# Altium schematic sheet controlo_rev3.SchDoc
size A3
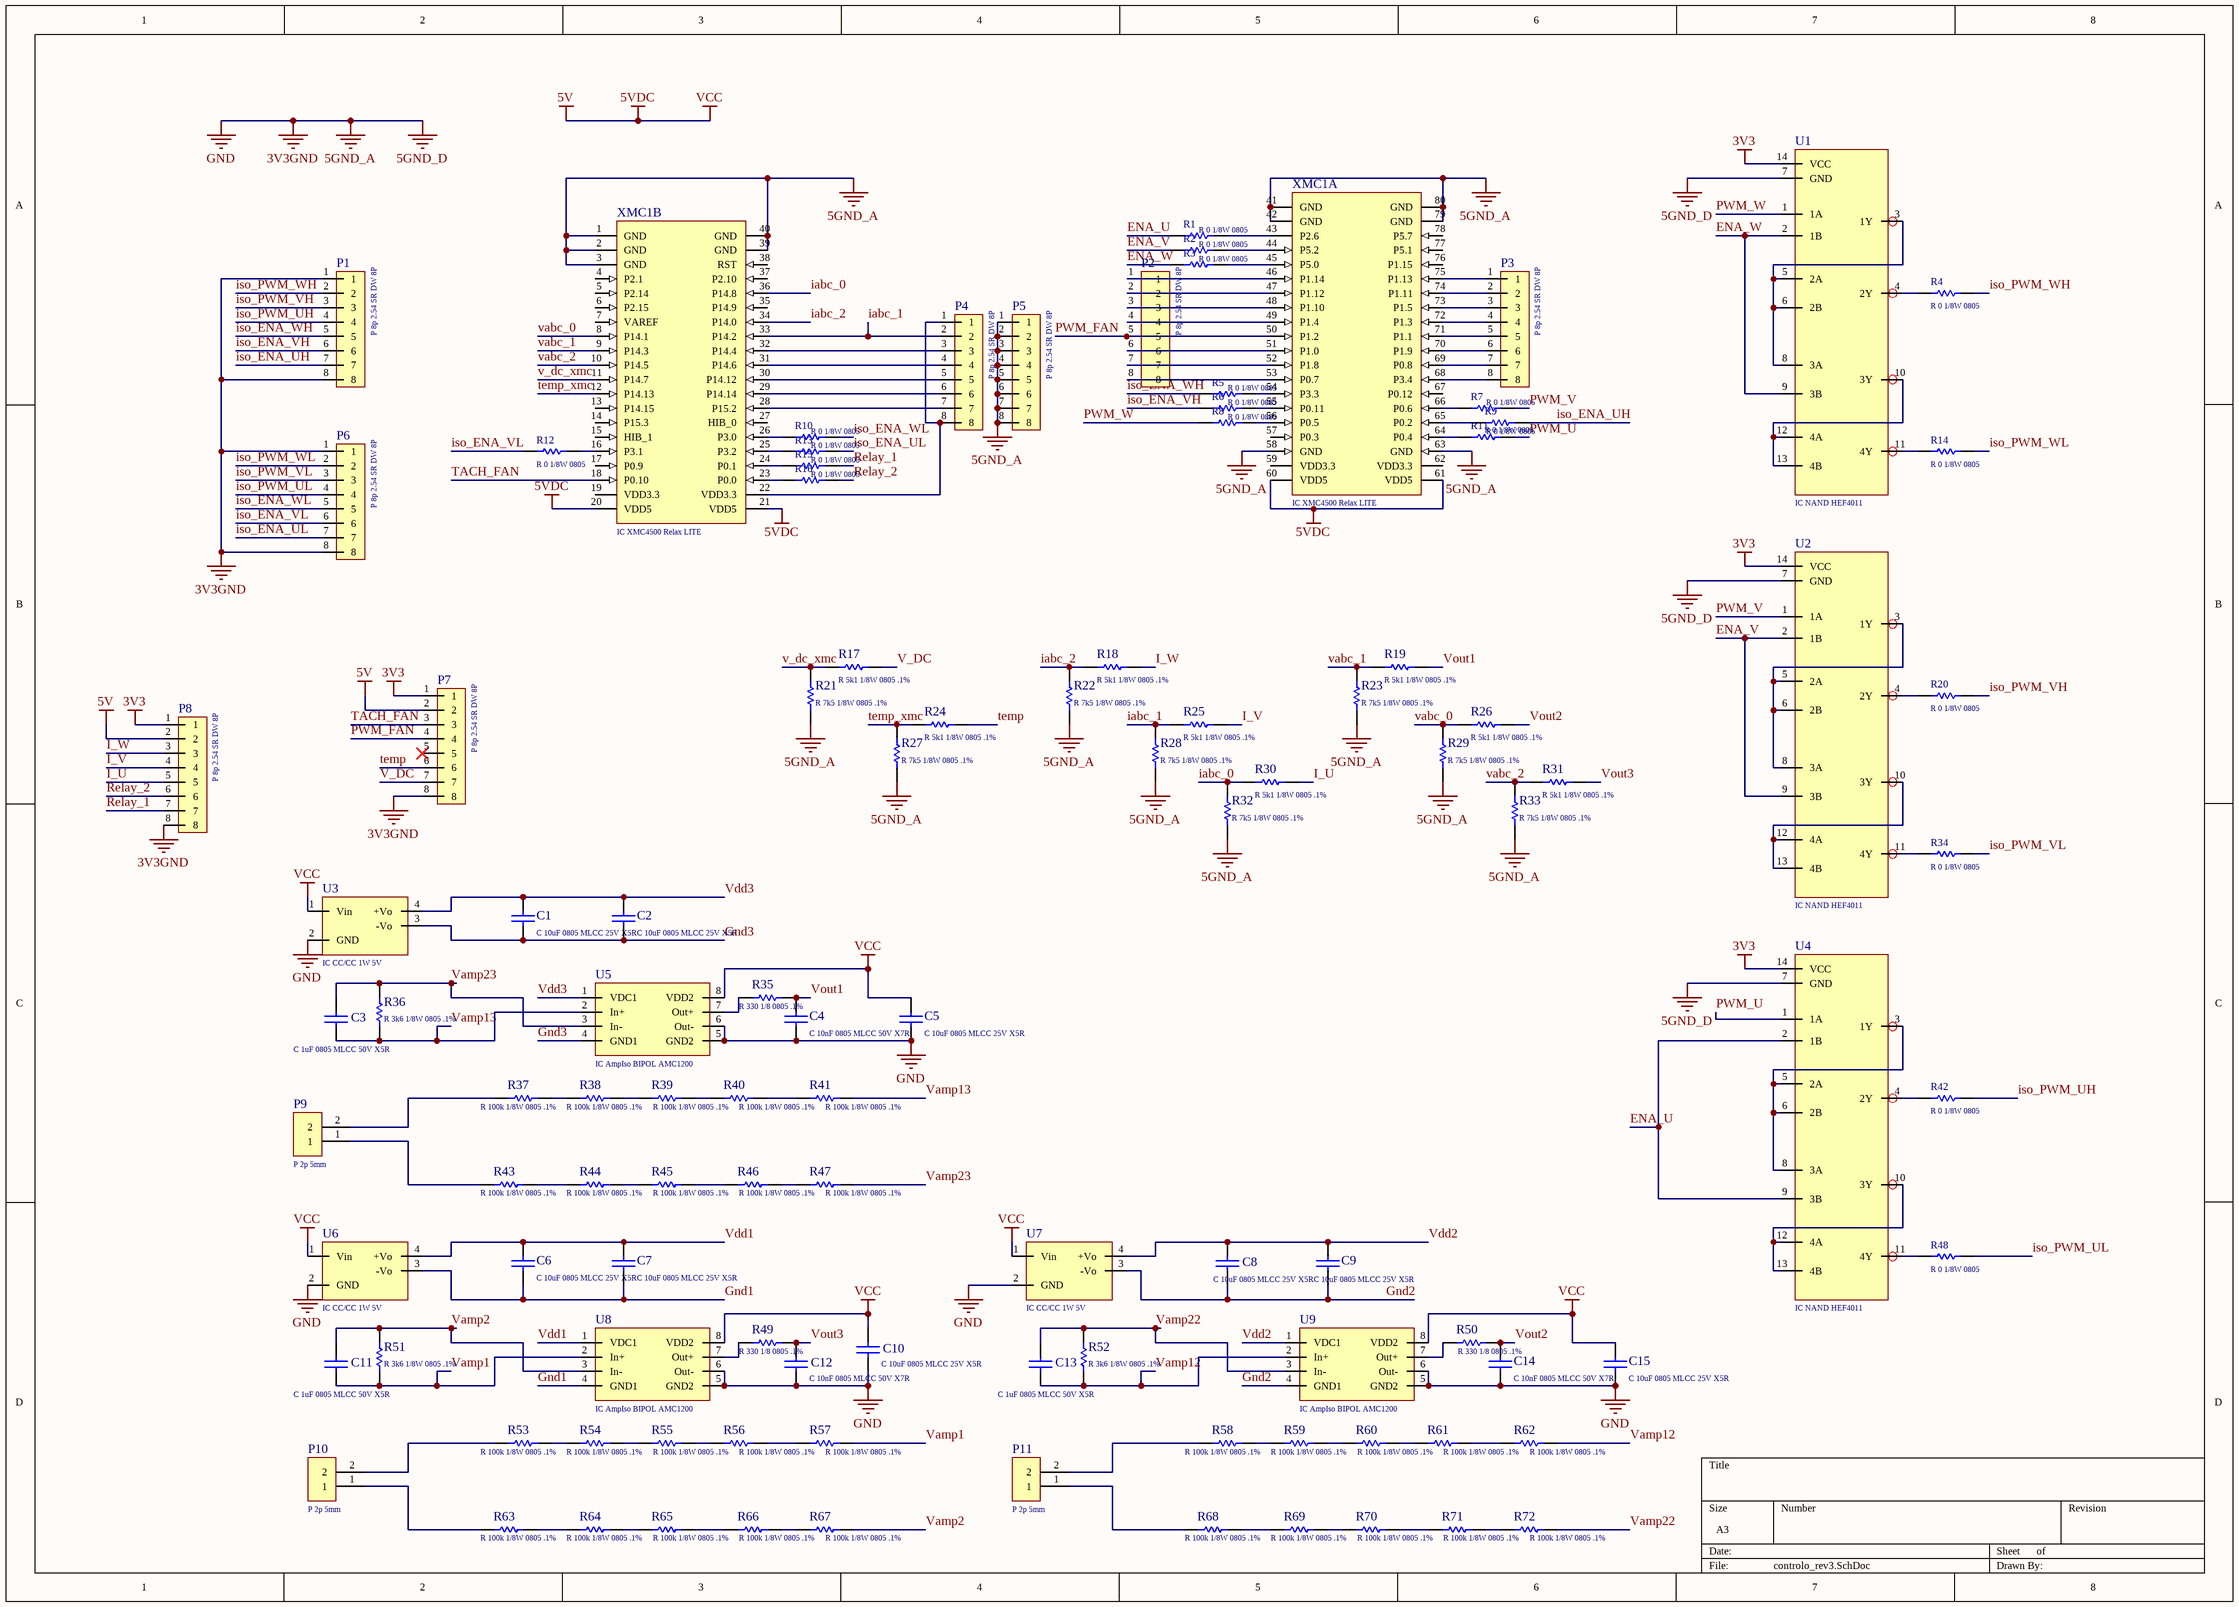
[diagram p0: controlo_rev3.SchDoc]

## Parts
C1  C 10uF 0805 MLCC 25V X5R  [CAPC_0805]
C2  C 10uF 0805 MLCC 25V X5R  [CAPC_0805]
C3  C 1uF 0805 MLCC 50V X5R  [CAPC_0805]
C4  C 10nF 0805 MLCC 50V X7R  [CAPC_0805]
C5  C 10uF 0805 MLCC 25V X5R  [CAPC_0805]
C6  C 10uF 0805 MLCC 25V X5R  [CAPC_0805]
C7  C 10uF 0805 MLCC 25V X5R  [CAPC_0805]
C8  C 10uF 0805 MLCC 25V X5R  [CAPC_0805]
C9  C 10uF 0805 MLCC 25V X5R  [CAPC_0805]
C10  C 10uF 0805 MLCC 25V X5R  [CAPC_0805]
C11  C 1uF 0805 MLCC 50V X5R  [CAPC_0805]
C12  C 10nF 0805 MLCC 50V X7R  [CAPC_0805]
C13  C 1uF 0805 MLCC 50V X5R  [CAPC_0805]
C14  C 10nF 0805 MLCC 50V X7R  [CAPC_0805]
C15  C 10uF 0805 MLCC 25V X5R  [CAPC_0805]
P1  P 8p 2.54 SR DW 8P  [Header 8x1 8.5mm]
P2  P 8p 2.54 SR DW 8P  [Header 8x1 8.5mm]
P3  P 8p 2.54 SR DW 8P  [Header 8x1 8.5mm]
P4  P 8p 2.54 SR DW 8P  [Header 8x1 8.5mm]
P5  P 8p 2.54 SR DW 8P  [Header 8x1 8.5mm]
P6  P 8p 2.54 SR DW 8P  [Header 8x1 8.5mm]
P7  P 8p 2.54 SR DW 8P  [Header 8x1 8.5mm]
P8  P 8p 2.54 SR DW 8P  [Header 8x1 8.5mm]
P9  P 2p 5mm  [connector1x2_parafuso]
P10  P 2p 5mm  [connector1x2_parafuso]
P11  P 2p 5mm  [connector1x2_parafuso]
R1  R 0 1/8W 0805  [RESC_0805]
R2  R 0 1/8W 0805  [RESC_0805]
R3  R 0 1/8W 0805  [RESC_0805]
R4  R 0 1/8W 0805  [RESC_0805]
R5  R 0 1/8W 0805  [RESC_0805]
R6  R 0 1/8W 0805  [RESC_0805]
R7  R 0 1/8W 0805  [RESC_0805]
R8  R 0 1/8W 0805  [RESC_0805]
R9  R 0 1/8W 0805  [RESC_0805]
R10  R 0 1/8W 0805  [RESC_0805]
R11  R 0 1/8W 0805  [RESC_0805]
R12  R 0 1/8W 0805  [RESC_0805]
R13  R 0 1/8W 0805  [RESC_0805]
R14  R 0 1/8W 0805  [RESC_0805]
R15  R 0 1/8W 0805  [RESC_0805]
R16  R 0 1/8W 0805  [RESC_0805]
R17  R 5k1 1/8W 0805 .1%  [RESC_0805]
R18  R 5k1 1/8W 0805 .1%  [RESC_0805]
R19  R 5k1 1/8W 0805 .1%  [RESC_0805]
R20  R 0 1/8W 0805  [RESC_0805]
R21  R 7k5 1/8W 0805 .1%  [RESC_0805]
R22  R 7k5 1/8W 0805 .1%  [RESC_0805]
R23  R 7k5 1/8W 0805 .1%  [RESC_0805]
R24  R 5k1 1/8W 0805 .1%  [RESC_0805]
R25  R 5k1 1/8W 0805 .1%  [RESC_0805]
R26  R 5k1 1/8W 0805 .1%  [RESC_0805]
R27  R 7k5 1/8W 0805 .1%  [RESC_0805]
R28  R 7k5 1/8W 0805 .1%  [RESC_0805]
R29  R 7k5 1/8W 0805 .1%  [RESC_0805]
R30  R 5k1 1/8W 0805 .1%  [RESC_0805]
R31  R 5k1 1/8W 0805 .1%  [RESC_0805]
R32  R 7k5 1/8W 0805 .1%  [RESC_0805]
R33  R 7k5 1/8W 0805 .1%  [RESC_0805]
R34  R 0 1/8W 0805  [RESC_0805]
R35  R 330 1/8 0805 .1%  [RESC_0805]
R36  R 3k6 1/8W 0805 .1%  [RESC_0805]
R37  R 100k 1/8W 0805 .1%  [RESC_0805]
R38  R 100k 1/8W 0805 .1%  [RESC_0805]
R39  R 100k 1/8W 0805 .1%  [RESC_0805]
R40  R 100k 1/8W 0805 .1%  [RESC_0805]
R41  R 100k 1/8W 0805 .1%  [RESC_0805]
R42  R 0 1/8W 0805  [RESC_0805]
R43  R 100k 1/8W 0805 .1%  [RESC_0805]
R44  R 100k 1/8W 0805 .1%  [RESC_0805]
R45  R 100k 1/8W 0805 .1%  [RESC_0805]
R46  R 100k 1/8W 0805 .1%  [RESC_0805]
R47  R 100k 1/8W 0805 .1%  [RESC_0805]
R48  R 0 1/8W 0805  [RESC_0805]
R49  R 330 1/8 0805 .1%  [RESC_0805]
R50  R 330 1/8 0805 .1%  [RESC_0805]
R51  R 3k6 1/8W 0805 .1%  [RESC_0805]
R52  R 3k6 1/8W 0805 .1%  [RESC_0805]
R53  R 100k 1/8W 0805 .1%  [RESC_0805]
R54  R 100k 1/8W 0805 .1%  [RESC_0805]
R55  R 100k 1/8W 0805 .1%  [RESC_0805]
R56  R 100k 1/8W 0805 .1%  [RESC_0805]
R57  R 100k 1/8W 0805 .1%  [RESC_0805]
R58  R 100k 1/8W 0805 .1%  [RESC_0805]
R59  R 100k 1/8W 0805 .1%  [RESC_0805]
R60  R 100k 1/8W 0805 .1%  [RESC_0805]
R61  R 100k 1/8W 0805 .1%  [RESC_0805]
R62  R 100k 1/8W 0805 .1%  [RESC_0805]
R63  R 100k 1/8W 0805 .1%  [RESC_0805]
R64  R 100k 1/8W 0805 .1%  [RESC_0805]
R65  R 100k 1/8W 0805 .1%  [RESC_0805]
R66  R 100k 1/8W 0805 .1%  [RESC_0805]
R67  R 100k 1/8W 0805 .1%  [RESC_0805]
R68  R 100k 1/8W 0805 .1%  [RESC_0805]
R69  R 100k 1/8W 0805 .1%  [RESC_0805]
R70  R 100k 1/8W 0805 .1%  [RESC_0805]
R71  R 100k 1/8W 0805 .1%  [RESC_0805]
R72  R 100k 1/8W 0805 .1%  [RESC_0805]
U1  IC NAND HEF4011  [SOIC-14N]
U2  IC NAND HEF4011  [SOIC-14N]
U3  IC CC/CC 1W 5V  [DC/DC_ISO]
U4  IC NAND HEF4011  [SOIC-14N]
U5  IC AmpIso BIPOL AMC1200  [SOIC8]
U6  IC CC/CC 1W 5V  [DC/DC_ISO]
U7  IC CC/CC 1W 5V  [DC/DC_ISO]
U8  IC AmpIso BIPOL AMC1200  [SOIC8]
U9  IC AmpIso BIPOL AMC1200  [SOIC8]
XMC1  IC XMC4500 Relax LITE  [XMC4500]  (parts A,B of 2)

## Nets
3V3: P7.1 P8.1 U1.14(VCC) U2.14(VCC) U4.14(VCC)
3V3GND: C4.1 C5.1 C10.1 C12.1 C14.1 C15.1 P1.1 P1.8 P5.1 P5.2 P5.3 P5.4 P5.5 P5.6 P5.7 P5.8 P6.1 P6.8 P7.8 P8.8 R21.1 R22.1 R23.1 R27.1 R28.1 R29.1 R32.1 R33.1 U1.7(GND) U2.7(GND) U3.2(GND) U4.7(GND) U5.5(GND2) U5.6(Out-) U6.2(GND) U7.2(GND) U8.5(GND2) U8.6(Out-) U9.5(GND2) U9.6(Out-) XMC1.1(GND) XMC1.2(GND) XMC1.3(GND) XMC1.39(GND) XMC1.40(GND) XMC1.41(GND) XMC1.42(GND) XMC1.58(GND) XMC1.63(GND) XMC1.79(GND) XMC1.80(GND)  [also labelled 5GND_A, 5GND_D, GND]
5V: C5.2 C10.2 C15.2 P7.2 P8.2 U3.1(Vin) U5.8(VDD2) U6.1(Vin) U7.1(Vin) U8.8(VDD2) U9.8(VDD2) XMC1.20(VDD5) XMC1.21(VDD5) XMC1.60(VDD5) XMC1.61(VDD5)  [also labelled 5VDC, VCC]
ENA_U: R1.1 U4.2(1B) U4.9(3B)
ENA_V: R2.1 U2.2(1B) U2.9(3B)
ENA_W: R3.1 U1.2(1B) U1.9(3B)
Gnd1: C6.1 C7.1 U6.3(-Vo) U8.4(GND1)
Gnd2: C8.1 C9.1 U7.3(-Vo) U9.4(GND1)
Gnd3: C1.1 C2.1 U3.3(-Vo) U5.4(GND1)
I_U: P8.5 R30.2
I_V: P8.4 R25.2
I_W: P8.3 R18.2
iabc_0: R30.1 R32.2 XMC1.36(P14.8)
iabc_1: P4.2 R25.1 R28.2 XMC1.33(P14.2)
iabc_2: R18.1 R22.2 XMC1.34(P14.0)
iso_ENA_UH: P1.7 R9.1
iso_ENA_UL: P6.7 R13.2
iso_ENA_VH: P1.6 R6.1
iso_ENA_VL: P6.6 R12.1
iso_ENA_WH: P1.5 R5.1
iso_ENA_WL: P6.5 R10.2
iso_PWM_UH: P1.4 R42.2
iso_PWM_UL: P6.4 R48.2
iso_PWM_VH: P1.3 R20.2
iso_PWM_VL: P6.3 R34.2
iso_PWM_WH: P1.2 R4.2
iso_PWM_WL: P6.2 R14.2
PWM_FAN: P2.5 P7.4 XMC1.50(P1.2)
PWM_U: R11.2 U4.1(1A)
PWM_V: R7.2 U2.1(1A)
PWM_W: R8.1 U1.1(1A)
Relay_1: P8.7 R15.2
Relay_2: P8.6 R16.2
TACH_FAN: P7.3 XMC1.18(P0.10)
temp: P7.6 R24.2
temp_xmc: R24.1 R27.2 XMC1.12(P14.13)
V_DC: P7.7 R17.2
v_dc_xmc: R17.1 R21.2 XMC1.11(P14.7)
vabc_0: R26.1 R29.2 XMC1.8(P14.1)
vabc_1: R19.1 R23.2 XMC1.9(P14.3)
vabc_2: R31.1 R33.2 XMC1.10(P14.5)
Vamp1: C11.1 R51.1 R57.2 U8.2(In+)
Vamp2: C11.2 R51.2 R67.2 U8.3(In-)
Vamp12: C13.1 R52.1 R62.2 U9.2(In+)
Vamp13: C3.1 R36.1 R41.2 U5.2(In+)
Vamp22: C13.2 R52.2 R72.2 U9.3(In-)
Vamp23: C3.2 R36.2 R47.2 U5.3(In-)
Vdd1: C6.2 C7.2 U6.4(+Vo) U8.1(VDC1)
Vdd2: C8.2 C9.2 U7.4(+Vo) U9.1(VDC1)
Vdd3: C1.2 C2.2 U3.4(+Vo) U5.1(VDC1)
Vout1: C4.2 R19.2 R35.2
Vout2: C14.2 R26.2 R50.2
Vout3: C12.2 R31.2 R49.2
NetP2_1: P2.1 XMC1.46(P1.14)
NetP2_2: P2.2 XMC1.47(P1.12)
NetP2_3: P2.3 XMC1.48(P1.10)
NetP2_4: P2.4 XMC1.49(P1.4)
NetP2_6: P2.6 XMC1.51(P1.0)
NetP2_7: P2.7 XMC1.52(P1.8)
NetP2_8: P2.8 XMC1.53(P0.7)
NetP3_1: P3.1 XMC1.75(P1.13)
NetP3_2: P3.2 XMC1.74(P1.11)
NetP3_3: P3.3 XMC1.73(P1.5)
NetP3_4: P3.4 XMC1.72(P1.3)
NetP3_5: P3.5 XMC1.71(P1.1)
NetP3_6: P3.6 XMC1.70(P1.9)
NetP3_7: P3.7 XMC1.69(P0.8)
NetP3_8: P3.8 XMC1.68(P3.4)
NetP4_1: P4.1 P4.8 XMC1.22(VDD3.3)
NetP4_3: P4.3 XMC1.32(P14.4)
NetP4_4: P4.4 XMC1.31(P14.6)
NetP4_5: P4.5 XMC1.30(P14.12)
NetP4_6: P4.6 XMC1.29(P14.14)
NetP4_7: P4.7 XMC1.28(P15.2)
NetP9_1: P9.1 R43.1
NetP9_2: P9.2 R37.1
NetP10_1: P10.1 R63.1
NetP10_2: P10.2 R53.1
NetP11_1: P11.1 R68.1
NetP11_2: P11.2 R58.1
NetR1_2: R1.2 XMC1.43(P2.6)
NetR2_2: R2.2 XMC1.44(P5.2)
NetR3_2: R3.2 XMC1.45(P5.0)
NetR4_1: R4.1 U1.4(2Y)
NetR5_2: R5.2 XMC1.54(P3.3)
NetR6_2: R6.2 XMC1.55(P0.11)
NetR7_1: R7.1 XMC1.66(P0.6)
NetR8_2: R8.2 XMC1.56(P0.5)
NetR9_2: R9.2 XMC1.65(P0.2)
NetR10_1: R10.1 XMC1.26(P3.0)
NetR11_1: R11.1 XMC1.64(P0.4)
NetR12_2: R12.2 XMC1.16(P3.1)
NetR13_1: R13.1 XMC1.25(P3.2)
NetR14_1: R14.1 U1.11(4Y)
NetR15_1: R15.1 XMC1.24(P0.1)
NetR16_1: R16.1 XMC1.23(P0.0)
NetR20_1: R20.1 U2.4(2Y)
NetR34_1: R34.1 U2.11(4Y)
NetR35_1: R35.1 U5.7(Out+)
NetR37_2: R37.2 R38.1
NetR38_2: R38.2 R39.1
NetR39_2: R39.2 R40.1
NetR40_2: R40.2 R41.1
NetR42_1: R42.1 U4.4(2Y)
NetR43_2: R43.2 R44.1
NetR44_2: R44.2 R45.1
NetR45_2: R45.2 R46.1
NetR46_2: R46.2 R47.1
NetR48_1: R48.1 U4.11(4Y)
NetR49_1: R49.1 U8.7(Out+)
NetR50_1: R50.1 U9.7(Out+)
NetR53_2: R53.2 R54.1
NetR54_2: R54.2 R55.1
NetR55_2: R55.2 R56.1
NetR56_2: R56.2 R57.1
NetR58_2: R58.2 R59.1
NetR59_2: R59.2 R60.1
NetR60_2: R60.2 R61.1
NetR61_2: R61.2 R62.1
NetR63_2: R63.2 R64.1
NetR64_2: R64.2 R65.1
NetR65_2: R65.2 R66.1
NetR66_2: R66.2 R67.1
NetR68_2: R68.2 R69.1
NetR69_2: R69.2 R70.1
NetR70_2: R70.2 R71.1
NetR71_2: R71.2 R72.1
NetU1_3: U1.3(1Y) U1.5(2A) U1.6(2B) U1.8(3A)
NetU1_10: U1.10(3Y) U1.12(4A) U1.13(4B)
NetU2_3: U2.3(1Y) U2.5(2A) U2.6(2B) U2.8(3A)
NetU2_10: U2.10(3Y) U2.12(4A) U2.13(4B)
NetU4_3: U4.3(1Y) U4.5(2A) U4.6(2B) U4.8(3A)
NetU4_10: U4.10(3Y) U4.12(4A) U4.13(4B)

Not connected (* = marked no-connect by the designer): P7 5*; XMC1 4(P2.1) 5(P2.14) 6(P2.15) 7(VAREF) 13(P14.15) 14(P15.3) 15(HIB_1) 17(P0.9) 19(VDD3.3) 27(HIB_0) 35(P14.9) 37(P2.10) 38(RST) 57(P0.3) 59(VDD3.3) 62(VDD3.3) 67(P0.12) 76(P1.15) 77(P5.1) 78(P5.7)

## Library data of the parts
C1 C2 C5-C10 C15 = Capacitor SMD: Capacitores de cerâmica multicamada MLCC - SMD/SMT 10uF 25V X5R +/-10% 0805 Gen Purp; Mouser VPN: 963-TMK212BBJ106KG-T; Price: 0,162
C3 C11 C13 = Capacitor SMD: Capacitores de cerâmica multicamada MLCC - SMD/SMT 0805 50V 1uF 20% X5R; Mouser VPN: 963-UMK212BJ105MG-T; Price: 0,153
C4 C12 C14 = Capacitor SMD: Capacitores de cerâmica multicamada MLCC - SMD/SMT 10nF 50V X7R 10%; Mouser VPN: 603-CC805KRX7R9BB103; Price: 0,099
P1-P8 = jumper_8p: Distribuidores e Alojamento de Fios CGrid Hrd SRDW THo le 8ckt; Mouser VPN: 538-87937-0800; Price: 0,621
P9-P11 = gen_purpose_conn_1x2: Bloques de terminales de PCB de perfil estándar RS de 5,0 mm; RS VPN: 896-6696; Price: 0,24
R1-R16 R20 R34 R42 R48 = Resistor: Resistores de Filme Espesso - SMD 1/8Watt 0ohms Commercial Use; Mouser VPN: 71-CRCW08050000Z0EAC; Price: 0,09
R17-R19 R24-R26 R30 R31 = Resistor: Resistores de Filme Fino - SMD 0805 5.1Kohm 1/8W .1% 25ppm; Mouser VPN: 667-ERA-6AEB512V; Price: 0,324
R21-R23 R27-R29 R32 R33 = Resistor: Resistores de Filme Fino - SMD 7.5K OHM .1% 25ppm; Mouser VPN: 66-PCF08C7.5KB; Price: 0,135
R35 R49 R50 = Resistor: Resistores de Filme Fino - SMD CPF 0805 330R 0.1% 25PPM 1K RL; Mouser VPN: 279-CPF0805B330RE1; Price: 0,126
R36 R51 R52 = Resistor: Resistores de Filme Fino - SMD 1/8W 3.6K ohm .1% 25ppm; Mouser VPN: 603-RT0805BRD073K6L; Price: 0,387
R37-R41 R43-R47 R53-R72 = Resistor: Resistores de Filme Fino - SMD 100 Kohm .1% 0805 25PPM; Mouser VPN: 284-APC0805B100KN; Price: 0,126
U1 U2 U4 = HEF4011: Portas lógicas QUADRUPLE 2-INPUT NAND GATE; Mouser VPN: 771-HEF4011BTD-T; Price: 0,296
U3 U6 U7 = DC/DC_ISO: Conversores CC/CC com isolação 1W 5Vin 5Vout 200mA SIP7; Mouser VPN: 919-RFB-0505S; Price: 1,4
U5 U8 U9 = AMC1200: Amplificadores de isolamento 4kV peak Iso Amp; Mouser VPN: 595-AMC1200BDWVR; Price: 4,62
XMC1 = XMC4500: "  KIT_XMC45_RELAX_LITE_V1 -  Evaluation Board, XMC4500 MCU, Detachable On-Board Debugger, USB Powered "; RS VPN: 251-8418; Farnell VPN: 2443552; Price: 14,628